# EAGLE design BT_Mate_MaKey (EAGLE 6.2)
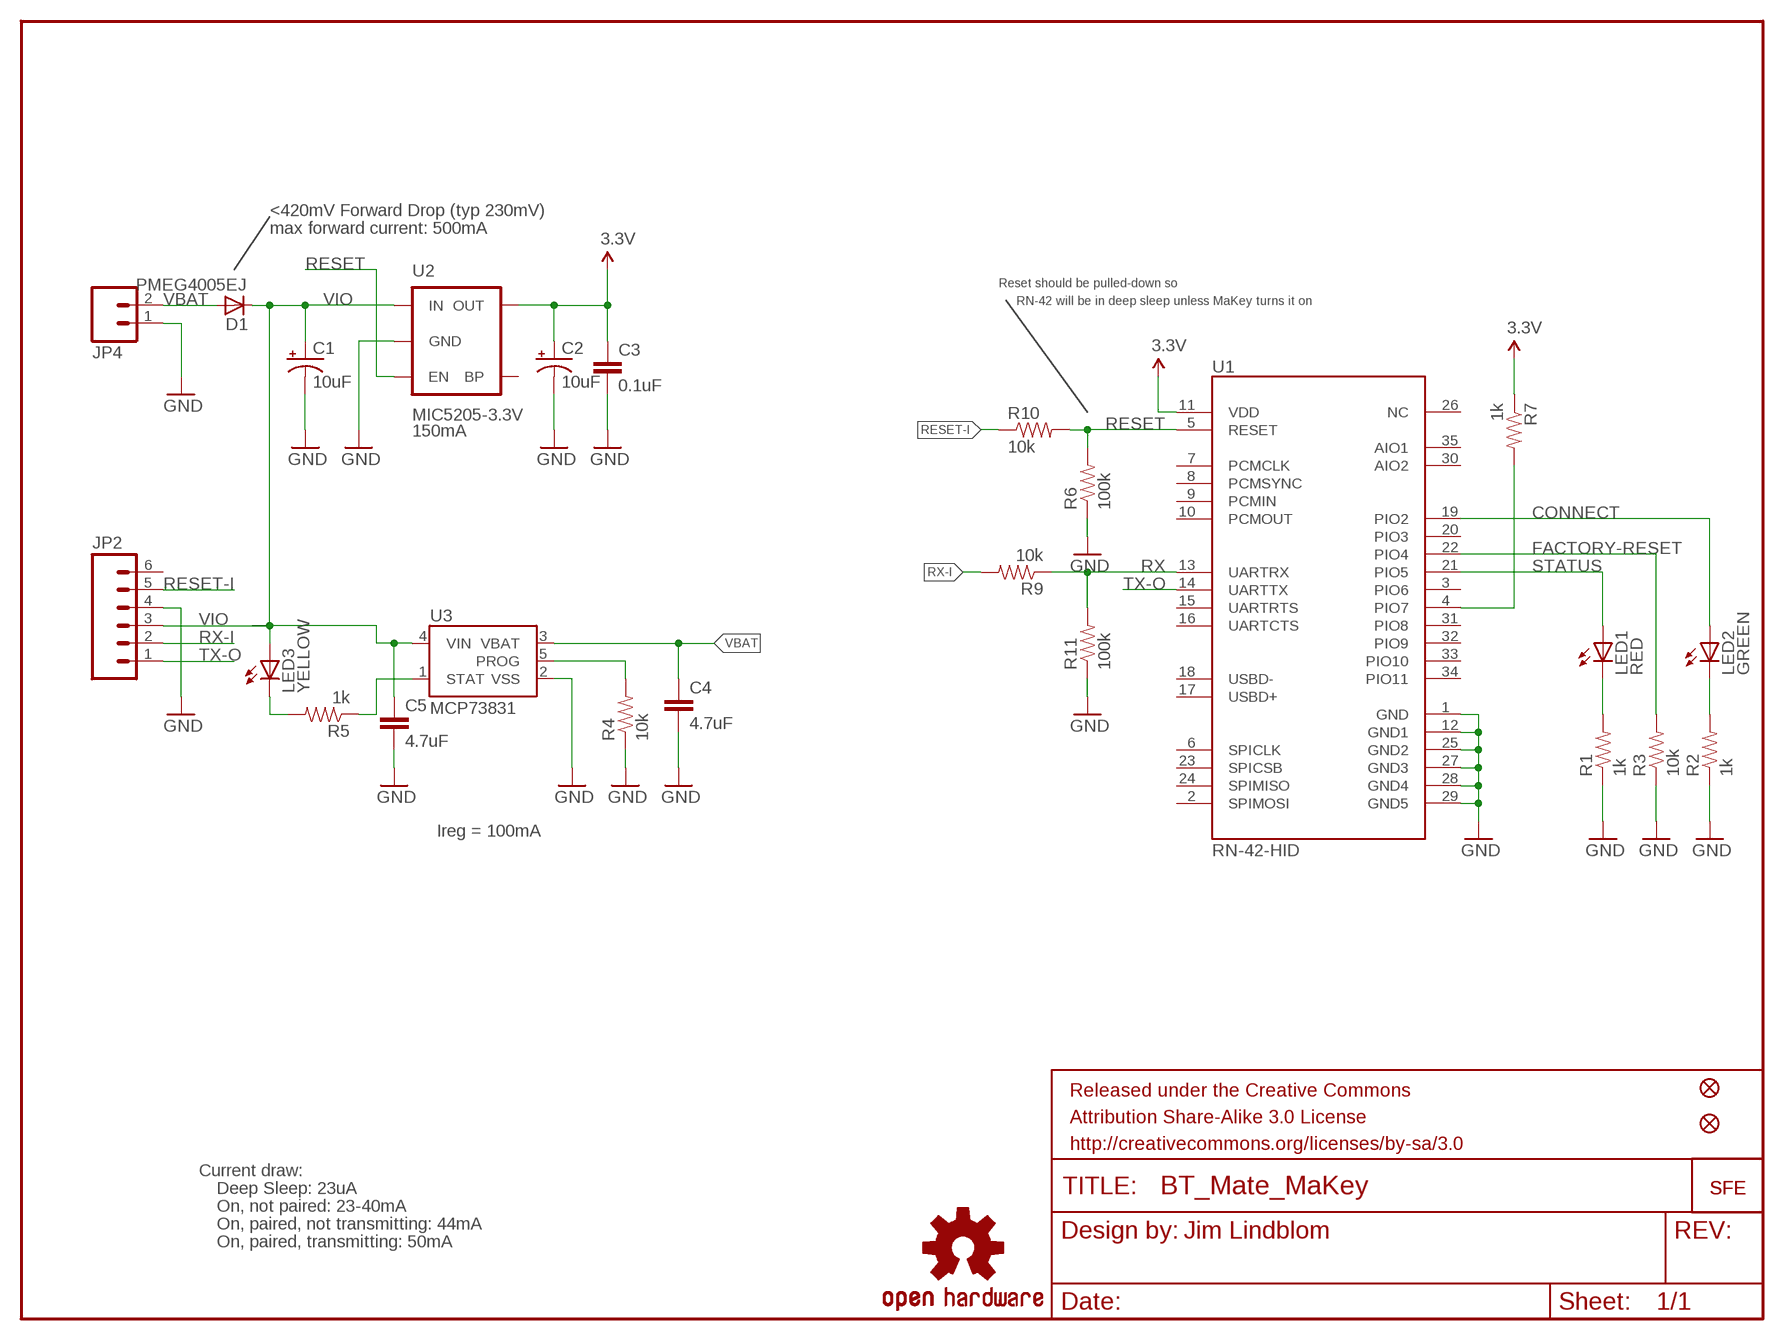
[diagram p0: schematic, sheet 1]

## Parts
C1  10uF  CAP_POL1206  [EIA3216]
C2  10uF  CAP_POL1206  [EIA3216]
C3  0.1uF  CAP0402-CAP  [0402-CAP]
C4  4.7uF  CAP0402-CAP  [0402-CAP]
C5  4.7uF  CAP0402-CAP  [0402-CAP]
D1  PMEG4005EJ  DIODESOD  [SOD-323]
JP1  LOGO-SFESK  [SFE-LOGO-FLAME]
JP2  M06SIP  [1X06]
JP3  LOGO-SFENW2  [SFE-NEW-WEB]
JP4  M02-JST-2MM-SMT  [JST-2-SMD]
JP5  FIDUCIALUFIDUCIAL  [MICRO-FIDUCIAL]
JP6  FIDUCIALUFIDUCIAL  [MICRO-FIDUCIAL]
LED1  RED  LED0603  [LED-0603]
LED2  GREEN  LED0603  [LED-0603]
LED3  YELLOW  LED0603  [LED-0603]
R1  1k  RESISTOR0402-RES  [0402-RES]
R2  1k  RESISTOR0402-RES  [0402-RES]
R3  10k  RESISTOR0402-RES  [0402-RES]
R4  10k  RESISTOR0402-RES  [0402-RES]
R5  1k  RESISTOR0402-RES  [0402-RES]
R6  100k  RESISTOR0402-RES  [0402-RES]
R7  1k  RESISTOR0402-RES  [0402-RES]
R9  10k  RESISTOR0402-RES  [0402-RES]
R10  10k  RESISTOR0402-RES  [0402-RES]
R11  100k  RESISTOR0402-RES  [0402-RES]
U1  RN-42-HID  BLUETOOTH-RN41"  [RN41]
U2  MIC5205-3.3V  V_REG_LDOSMD  [SOT23-5]
U3  MCP73831  [SOT23-5]
U$2  OSHW-LOGOS  [OSHW-LOGO-S]

## Nets
3.3V: C2.A(+) C3.1 R7.1 U1.11(VDD) U2.5(OUT)
CONNECT: LED2.A U1.19(PIO2)
FACTORY-RESET: R3.2 U1.22(PIO4)
GND: C1.C(-) C2.C(-) C3.2 C4.2 C5.2 JP2.4 JP4.1 R1.1 R2.1 R3.1 R4.1 R6.1 R11.1 U1.1(GND) U1.12(GND1) U1.25(GND2) U1.27(GND3) U1.28(GND4) U1.29(GND5) U2.2(GND) U3.2(VSS)
N$1: R7.2 U1.4(PIO7)
N$2: LED1.C R1.2
N$3: LED2.C R2.2
N$4: R4.2 U3.5(PROG)
N$6: R5.1 U3.1(STAT)
N$7: LED3.C R5.2
RESET: R6.2 R10.2 U1.5(RESET) U2.3(EN)
RESET-I: JP2.5 R10.1
RX: R9.1 R11.2 U1.13(UARTRX)
RX-I: JP2.2 R9.2
STATUS: LED1.A U1.21(PIO5)
TX-O: JP2.1 U1.14(UARTTX)
VBAT: C4.1 D1.2(A) JP4.2 U3.3(VBAT)
VIO: C1.A(+) C5.1 D1.1(C) JP2.3 LED3.A U2.1(IN) U3.4(VIN)
Unconnected: JP2.6 U1.2(SPIMOSI) U1.3(PIO6) U1.6(SPICLK) U1.7(PCMCLK) U1.8(PCMSYNC) U1.9(PCMIN) U1.10(PCMOUT) U1.15(UARTRTS) U1.16(UARTCTS) U1.17(USBD+) U1.18(USBD-) U1.20(PIO3) U1.23(SPICSB) U1.24(SPIMISO) U1.26(NC) U1.30(AIO2) U1.31(PIO8) U1.32(PIO9) U1.33(PIO10) U1.34(PIO11) U1.35(AIO1) U2.4(BP)

## Notes on the sheet
- <420mV Forward Drop (typ 230mV)
- max forward current: 500mA
- Reset should be pulled-down so
- RN-42 will be in deep sleep unless MaKey turns it on
- 150mA
- Ireg = 100mA
- Current draw:
- Deep Sleep: 23uA
- On, not paired: 23-40mA
- On, paired, not transmitting: 44mA
- Jim Lindblom
- On, paired, transmitting: 50mA

## Library data of the parts
C1 C2 = SparkFun-Passives:CAP_POL: Capacitor Polarized These are standard SMD and PTH capacitors. Normally 10uF, 47uF, and 100uF in electrolytic and tantalum varieties. Always verify the external diameter of the through hole cap, it varies with capacity, voltage, and manufacturer. The EIA devices should be standard.
C3-C5 = SparkFun-Passives:CAP: Capacitor Standard 0603 ceramic capacitor, and 0.1" leaded capacitor.
D1 = SparkFun-DiscreteSemi:DIODE: Diode These are standard reverse protection diodes and small signal diodes. SMA package can handle up to about 1A. SOD-323 can handle about 200mA. What the SOD-323 package when ordering, there are some mfgs out there that are 5-pin packages.
JP1 JP3 = SparkFun-Aesthetics:LOGO-SFE: Spark Fun Electronics PCB Logo This is the standard Spark Fun Electronics PCB logo.
JP2 = SparkFun-Connectors:M06: Header 6 Standard 6-pin 0.1" header. Use with straight break away headers (SKU : PRT-00116), right angle break away headers (PRT-00553), swiss pins (PRT-00743), machine pins (PRT-00117), and female headers (PRT-00115). Molex polarized connector foot print use with SKU : PRT-08094 with associated crimp pins and housings. NOTES ON THE VARIANTS LOCK and LOCK_LONGPADS... This footprint was designed to help hold the alignment of a through-hole component (i.e. 6-pin header) while soldering it into place. You may notice that each hole has been shifted either up or down by 0.005 of an inch from it's more standard position (which is a perfectly straight line). This slight alteration caused the pins (the squares in the middle) to touch the edges of the holes. Because they are alternating, it causes a "brace" to hold the component in place. 0.005 has proven to be the perfect amount of "off-center" position when using our standard breakaway headers. Although looks a little odd when you look at the bare footprint, once you have a header in there, the alteration is very hard to notice. Also, if you push a header all the way into place, it is covered up entirely on the bottom side. This idea of altering the position of holes to aid alignment will be further integrated into the Sparkfun Library for other footprints. It can help hold any component with 3 or more connection pins.
JP4 = SparkFun-Connectors:M02: Header 2 Standard 2-pin 0.1" header. Use with straight break away headers (SKU : PRT-00116), right angle break away headers (PRT-00553), swiss pins (PRT-00743), machine pins (PRT-00117), and female headers (PRT-00115). Molex polarized connector foot print use with SKU : PRT-08233 with associated crimp pins and housings.
JP5 JP6 = SparkFun:FIDUCIAL: Fiducial Alignment Points Various fiducial points for machine vision alignment.
LED1-LED3 = SparkFun-LED:LED: LEDs Standard schematic elements and footprints for 5mm, 3mm, 1206, and 0603 sized LEDs. 5mm - Spark Fun Electronics SKU : COM-00529 (and others)
R1-R7 R9-R11 = SparkFun-Passives:RESISTOR: Resistor Basic schematic elements and footprints for 0603, 1206, and PTH resistors.
U1 = SparkFun-RF:BLUETOOTH-RN41: Bluetooth SMD module
U2 = SparkFun-PowerIC:V_REG_LDO: Voltage Regulator LDO Standard 150mA LDO voltage regulator in SOT-23 layout. Micrel part MIC5205. BP (by-pass) pin is used to lower output noise with 470pF cap.
U3 = SparkFun-PowerIC:MCP73831: Miniature single cell, fully integrated Li-Ion, Li-polymer charge management controller http://ww1.microchip.com/downloads/en/DeviceDoc/21984a.pdf
U$2 = SparkFun-Aesthetics:OSHW-LOGO: Open Source Hardware Logo This logo indicates the piece of hardware it is found on incorporates a OSHW license and/or adheres to the definition of open source hardware found here: http://freedomdefined.org/OSHW

## Board
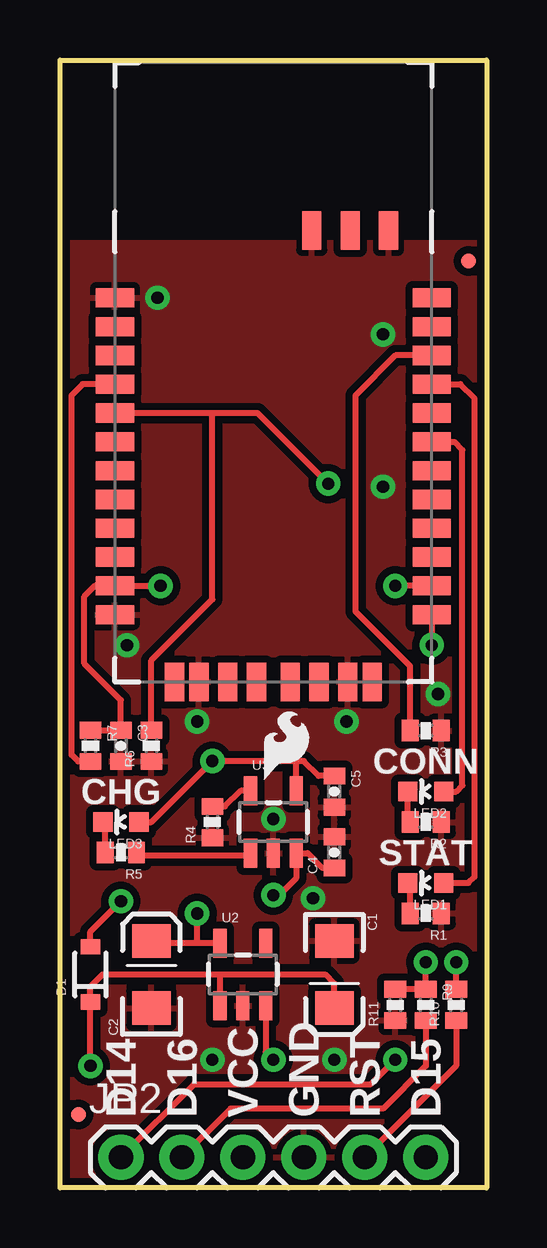
[diagram p1: board, top side]
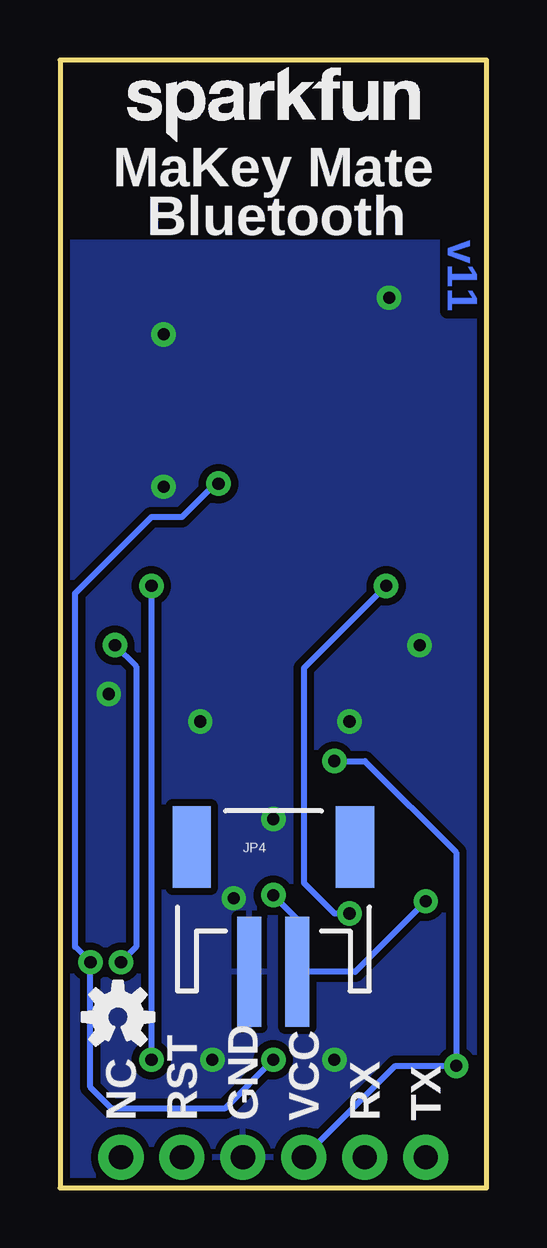
[diagram p2: board, bottom side, seen from below]

Size 17.78 x 46.99 mm. Coordinates in mm from the lower left corner, seen from the top.
Outline: 0,0 0,46.99 17.78,46.99 17.78,0 0,0
Copper layers (1*16): Top 0.035mm / dielectric 1.5mm / Bottom 0.035mm
Design rules: minimum track width 8mil, minimum drill 20mil, track to track 8mil, track to pad 8mil, pad to pad 8mil, via to via 8mil, smd to smd 8mil, copper to edge 8mil, drill to drill 8mil, minimum pad ring 12mil, minimum via ring 10mil, stop-mask expansion 4mil, vias tented up to drill 20mil, thermal gap 10mil

### Footprints (pad centres in the part's own frame; a part is rotated, then mirrored left to right if it is on the bottom)
EIA3216 = smd 1.4 x 1.6: A 1.4,0; C -1.4,0
0402-CAP = smd 0.7 x 0.9: 1 -0.65,0; 2 0.65,0
SOD-323 = smd 0.63 x 0.83: 1 -1.15,0; 2 1.15,0
1X06 = drill 1.016 pad 1.88: 1 0,0; 2 2.54,0; 3 5.08,0; 4 7.62,0; 5 10.16,0; 6 12.7,0
JST-2-SMD = smd 1 x 4.6: 1 -1,-3.7; 2 1,-3.7 | smd 1.6 x 3.4: NC1 -3.4,1.5; NC2 3.4,1.5
MICRO-FIDUCIAL = smd 0.635 x 0.635: 1 0,0
LED-0603 = smd 0.8 x 0.8: A 0,-0.75; C 0,0.75
0402-RES = smd 0.7 x 0.9: 1 -0.65,0; 2 0.65,0
RN41 = smd 0.8 x 1.6: 1 -6.6,-6.6; 2 -5.4,-6.6; 3 -4.2,-6.6; 4 -3,-6.6; 5 -1.8,-6.6; 6 -0.6,-6.6; 7 0.6,-6.6; 8 1.8,-6.6; 9 3,-6.6; 10 4.2,-6.6; 11 5.4,-6.6; 12 6.6,-6.6; 13 6.6,6.6; 14 5.4,6.6; 15 4.2,6.6; 16 3,6.6; 17 1.8,6.6; 18 0.6,6.6; 19 -0.6,6.6; 20 -1.8,6.6; 21 -3,6.6; 22 -4.2,6.6; 23 -5.4,6.6; 24 -6.6,6.6 | smd 1.6 x 0.8: 25 -9.4,4.8; 26 -9.4,3.2; 27 -9.4,1.6; 28 9.4,3.1; 29 9.4,-3.1; 30 9.4,-4.122; 31 9.4,-1.9; 32 9.4,-0.7; 33 9.4,0.7; 34 9.4,1.9; 35 9.4,4.122
SOT23-5 = smd 0.55 x 1.2: 1 -0.95,-1.3; 2 0,-1.3; 3 0.95,-1.3; 4 0.95,1.3; 5 -0.95,1.3

### Placement (x,y rotation side)
C1  11.43,8.89 270 top
C2  3.81,8.89 90 top
C3  2.54,18.41 270 top
C4  11.43,13.97 90 top
C5  11.43,16.51 270 top
D1  1.27,8.89 90 top
JP1  8.51,17.02 0 top
JP2  2.54,1.27 0 top
JP3  14.99,43.56 0 bottom
JP4  8.89,12.7 0 bottom
JP5  0.76,3.05 0 top
JP6  17.02,38.61 0 top
LED1  15.24,12.7 90 top
LED2  15.24,16.51 90 top
LED3  2.54,15.24 90 top
R1  15.24,11.43 180 top
R2  15.24,15.24 180 top
R3  15.24,19.05 180 top
R4  6.35,15.24 90 top
R5  2.54,13.97 180 top
R6  3.81,18.41 90 top
R7  1.27,18.41 270 top
R9  15.24,7.62 270 top
R10  16.51,7.62 90 top
R11  13.97,7.62 90 top
U1  8.89,30.48 270 top
U2  7.62,8.89 0 top
U3  8.89,15.24 0 top
U$2  15.37,7.11 0 bottom

### Tracks (layer width: path | path; a pad name or v marks a point on that pad's centre or on a via)
3.3V  (via drill 0.51)
  Top 0.254: U2.5 5.71,10.19 | v4.19,25.08 U1.11 1.46,25.08 1.02,24.64 1.02,21.84 2.54,20.32 C3.1 R7.1 | 5.71,10.19 3.91,10.19 C2.A | 5.71,10.19 v5.71,11.43
  Bottom 0.254: v4.19,25.08 7.62,21.65 7.62,12.7 6.35,11.43 v5.71,11.43
CONNECT
  Top 0.254: LED2.A 16.51,16.51 16.76,16.76 16.76,30.73 16.42,31.08 U1.19
FACTORY-RESET
  Top 0.254: R3.2 14.59,21.73 12.32,24 12.32,33.02 13.98,34.68 U1.22
GND  (via drill 0.51)
  other vias: 6.35,5.33 11.94,19.43 11.43,5.33 13.46,29.21 8.89,15.37 2.79,22.61 13.46,35.56 10.54,12.06 15.75,20.57 5.71,19.43 4.06,37.08
  pour Top (isolate 0.305): 0,0 0,39.37 17.78,39.37 17.78,0
  pour Bottom (isolate 0.305): 0,0 0,39.37 17.78,39.37 17.78,0
N$1
  Top 0.254: U1.4 0.94,33.48 0.48,33.02 0.48,18.03 0.75,17.77 R7.2
N$2
  Top 0.254: R1.2 14.59,12.6 LED1.C
N$3
  Top 0.254: R2.2 14.49,15.34 LED2.C
N$4
  Top 0.254: R4.2 6.87,15.89 7.52,16.54 U3.5
N$6
  Top 0.254: R5.1 3.32,13.84 7.84,13.84 U3.1
N$7
  Top 0.254: R5.2 1.89,15.14 LED3.C
RESET  (via drill 0.51)
  Top 0.254: 6.35,32.28 8.23,32.28 v11.18,29.34 | 6.35,32.28 U1.5 | 6.35,32.28 6.35,24.51 3.81,21.97 R6.2 | R10.2 v16.51,9.4 | U2.3 8.57,5.65 v8.89,5.33
  Bottom 0.254: v11.18,29.34 11.3,29.34 12.7,27.94 13.97,27.94 17.14,24.77 17.14,10.03 v16.51,9.4 16.51,4.19 15.62,3.3 10.92,3.3 v8.89,5.33
RESET-I
  Top 0.254: R10.1 16.51,5.08 JP2.5
RX  (via drill 0.51)
  Top 0.254: U1.13 v15.49,22.61 | R11.2 R9.1 v15.24,9.4
  Bottom 0.254: v15.49,22.61 14.61,21.73 14.61,10.03 v15.24,9.4
RX-I
  Top 0.254: JP2.2 7.11,3.3 13.46,3.3 15.24,5.08 R9.2
STATUS
  Top 0.254: LED1.A 17.02,12.7 17.27,12.95 17.27,32.89 16.68,33.48 U1.21
TX-O  (via drill 0.51)
  Top 0.254: JP2.1 5.59,4.32 12.95,4.32 v13.97,5.33 | U1.14 v13.97,25.08
  Bottom 0.254: v13.97,25.08 v13.97,5.33
VBAT  (via drill 0.51)
  Top 0.254: C4.1 10.94,13.32 10.32,13.94 U3.3 9.84,12.89 9.14,12.19 v8.89,12.19 | D1.2 1.27,10.67 v2.54,11.94
  Bottom 0.254: v2.54,11.94 5.48,9 JP4.2 7.89,11.19 v8.89,12.19
VIO  (via drill 0.51)
  Top 0.254: 6.64,7.62 U2.1 6.67,8.83 6.73,8.89 | 6.73,8.89 1.78,8.89 1.27,8.38 D1.1 v1.27,5.08 | 6.73,8.89 11.05,8.89 11.43,8.51 C1.A | C5.1 10.78,17.16 10.16,17.78 9.78,17.78 | 9.78,17.78 v6.35,17.78 3.81,15.24 LED3.A | U3.4 9.84,17.72 9.78,17.78
  Bottom 0.254: JP2.3 3.81,5.08 v1.27,5.08 1.27,13.97 5.08,17.78 v6.35,17.78

### Text on the board
Bottom: v11
tPlace: CONN | CHG | STAT | D14 | D16 | VCC | GND | RST | D15
bPlace: MaKey Mate | Bluetooth | TX | RX | VCC | GND | RST | NC